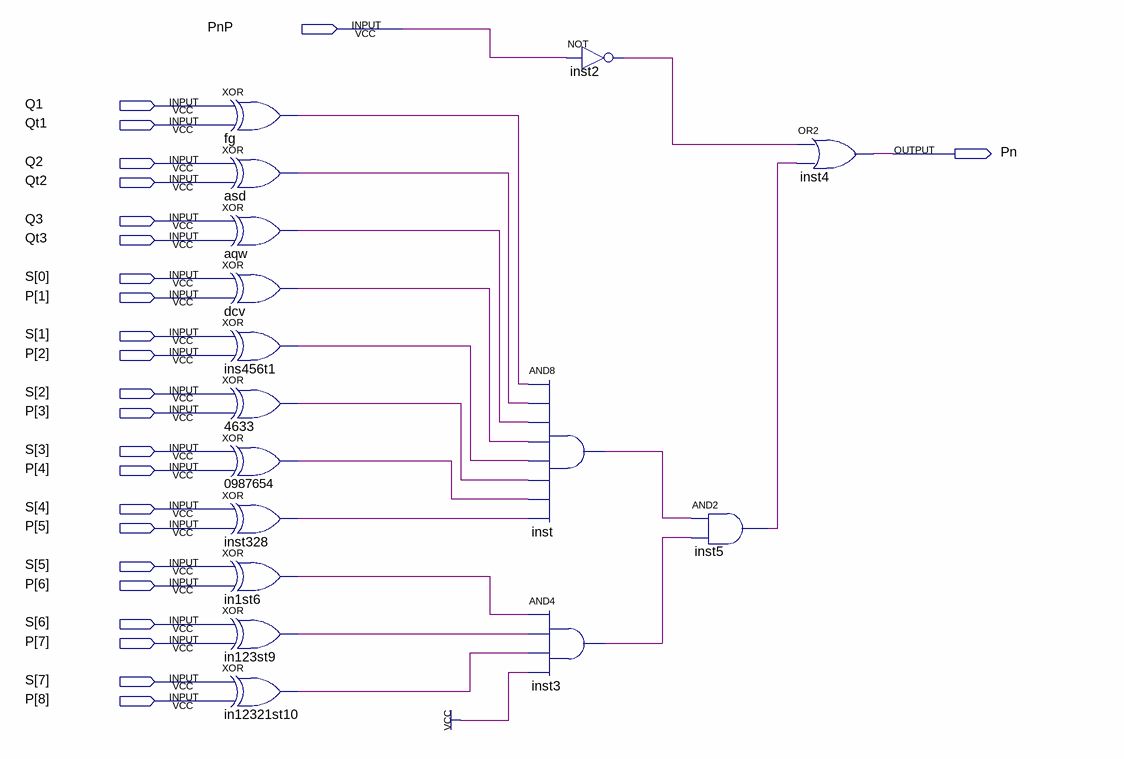
[diagram p0: schematic sheet]
// Quartus schematic Pn.bdf as structural Verilog: 16 symbols, 24 pins
module Pn (
  input  PnP,
  input  Q1,
  input  Qt1,
  input  Q2,
  input  Qt2,
  input  Q3,
  input  Qt3,
  input  [7:0] S,
  input  [8:1] P,
  output Pn
);

  wire aqw_out, asd_out, dcv_out, fg_out, in1st6_out, in123st9_out, in12321st10_out, ins456t1_out, inst2_out,
       inst3_out, inst5_out, inst328_out, inst_out, n4633_out, n0987654_out;

  xor fg (fg_out, Q1, Qt1);
  xor asd (asd_out, Q2, Qt2);
  xor aqw (aqw_out, Q3, Qt3);
  xor dcv (dcv_out, S[0], P[1]);
  xor ins456t1 (ins456t1_out, S[1], P[2]);
  xor u_4633 (n4633_out, S[2], P[3]);
  xor u_0987654 (n0987654_out, S[3], P[4]);
  xor inst328 (inst328_out, S[4], P[5]);
  xor in1st6 (in1st6_out, S[5], P[6]);
  xor in123st9 (in123st9_out, S[6], P[7]);
  xor in12321st10 (in12321st10_out, S[7], P[8]);
  and inst (inst_out, fg_out, asd_out, aqw_out, dcv_out, ins456t1_out, n4633_out, n0987654_out, inst328_out);
  and inst3 (inst3_out, in1st6_out, in123st9_out, in12321st10_out, 1'b1);
  not inst2 (inst2_out, PnP);
  and inst5 (inst5_out, inst_out, inst3_out);
  or inst4 (Pn, inst2_out, inst5_out);
endmodule
